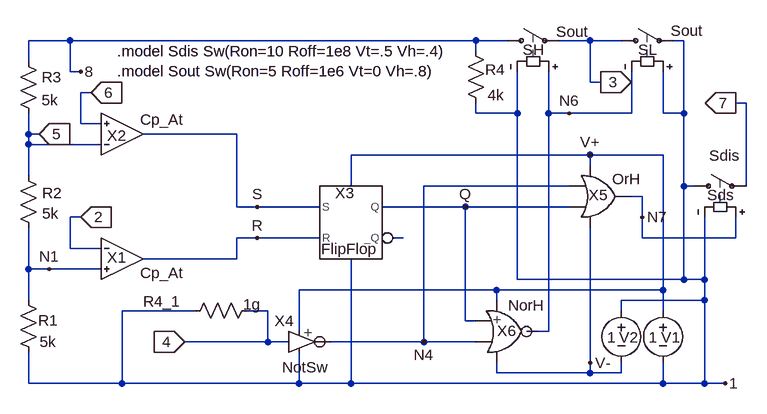
[diagram p0: schematic 555Atan.asc]
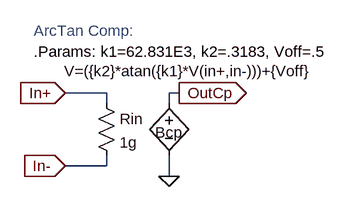
[diagram p1: sub-circuit comp_at.asc]
555Atan.asc, the LTspice schematic file:
Version 4
SHEET 1 880 780
WIRE -576 128 -576 96
WIRE -576 240 -576 208
WIRE -576 256 -576 240
WIRE -576 304 -576 256
WIRE -576 448 -576 384
WIRE -576 496 -576 448
WIRE -576 624 -576 576
WIRE -560 240 -576 240
WIRE -544 448 -576 448
WIRE -512 96 -576 96
WIRE -512 144 -512 96
WIRE -512 416 -512 368
WIRE -496 144 -512 144
WIRE -496 224 -496 176
WIRE -496 368 -512 368
WIRE -480 176 -496 176
WIRE -464 224 -496 224
WIRE -464 256 -576 256
WIRE -464 416 -512 416
WIRE -464 448 -544 448
WIRE -432 624 -576 624
WIRE -432 624 -432 512
WIRE -320 512 -432 512
WIRE -256 240 -400 240
WIRE -256 352 -256 240
WIRE -256 432 -400 432
WIRE -256 432 -256 400
WIRE -224 352 -256 352
WIRE -224 400 -256 400
WIRE -208 512 -240 512
WIRE -208 560 -336 560
WIRE -208 560 -208 512
WIRE -176 560 -208 560
WIRE -160 544 -160 480
WIRE -160 624 -432 624
WIRE -160 624 -160 576
WIRE -128 352 -224 352
WIRE -128 400 -224 400
WIRE -80 320 -80 272
WIRE -80 624 -160 624
WIRE -80 624 -80 432
WIRE 0 400 -16 400
WIRE 32 560 -112 560
WIRE 32 560 32 320
WIRE 96 352 -32 352
WIRE 96 528 96 352
WIRE 112 96 -512 96
WIRE 112 112 112 96
WIRE 112 208 112 192
WIRE 112 528 96 528
WIRE 112 560 32 560
WIRE 144 480 -160 480
WIRE 144 496 144 480
WIRE 144 608 144 592
WIRE 160 96 112 96
WIRE 176 208 112 208
WIRE 176 208 176 144
WIRE 176 464 176 208
WIRE 224 208 224 144
WIRE 224 544 208 544
WIRE 224 544 224 208
WIRE 256 208 224 208
WIRE 256 320 32 320
WIRE 256 352 96 352
WIRE 288 96 240 96
WIRE 288 160 288 96
WIRE 288 272 -80 272
WIRE 288 288 288 272
WIRE 288 592 288 384
WIRE 288 608 144 608
WIRE 288 608 288 592
WIRE 304 160 288 160
WIRE 336 96 288 96
WIRE 336 512 336 496
WIRE 336 608 288 608
WIRE 336 608 336 592
WIRE 352 208 256 208
WIRE 352 208 352 144
WIRE 368 336 352 336
WIRE 368 368 368 336
WIRE 368 400 368 368
WIRE 400 208 400 144
WIRE 400 272 288 272
WIRE 400 480 144 480
WIRE 400 480 400 272
WIRE 400 512 400 480
WIRE 400 624 -80 624
WIRE 400 624 400 592
WIRE 432 96 416 96
WIRE 432 208 400 208
WIRE 432 208 432 96
WIRE 432 320 432 208
WIRE 432 464 176 464
WIRE 432 464 432 320
WIRE 448 320 432 320
WIRE 464 464 432 464
WIRE 464 464 464 368
WIRE 464 496 336 496
WIRE 464 496 464 464
WIRE 464 624 400 624
WIRE 464 624 464 496
WIRE 496 624 464 624
WIRE 512 400 368 400
WIRE 512 400 512 368
WIRE 528 192 512 192
WIRE 528 320 528 192
FLAG -544 448 N1
FLAG -224 400 R
FLAG -496 368 2
IOPIN -496 368 In
FLAG -560 240 5
IOPIN -560 240 In
FLAG 512 192 7
IOPIN 512 192 Out
FLAG 368 368 N7
FLAG -224 352 S
FLAG 96 352 Q
FLAG -480 176 6
IOPIN -480 176 In
FLAG -496 144 8
FLAG 304 160 3
IOPIN 304 160 Out
FLAG 256 208 N6
FLAG 496 624 1
FLAG 32 560 N4
FLAG -336 560 4
IOPIN -336 560 In
FLAG 288 592 V-
FLAG 288 272 V+
SYMBOL res -592 480 R0
WINDOW 0 31 47 Left 0
WINDOW 3 33 80 Left 0
SYMATTR InstName R1
SYMATTR Value 5k
SYMBOL res -592 288 R0
WINDOW 0 37 43 Left 0
WINDOW 3 37 74 Left 0
SYMATTR InstName R2
SYMATTR Value 5k
SYMBOL res -592 112 R0
SYMATTR InstName R3
SYMATTR Value 5k
SYMBOL sw 432 320 R270
WINDOW 0 -14 36 VRight 0
WINDOW 3 47 39 VRight 0
SYMATTR InstName Sds
SYMATTR Value Sdis
SYMBOL sw 144 96 R270
WINDOW 0 -14 40 VRight 0
WINDOW 3 14 92 VRight 0
SYMATTR InstName SH
SYMATTR Value Sout
SYMBOL sw 320 96 R270
WINDOW 0 -14 42 VRight 0
WINDOW 3 15 92 VRight 0
SYMATTR InstName SL
SYMATTR Value Sout
SYMBOL res 128 208 R180
WINDOW 0 -29 67 Left 0
WINDOW 3 -28 28 Left 0
SYMATTR InstName R4
SYMATTR Value 4k
SYMBOL voltage 400 496 R0
WINDOW 0 -3 57 Left 0
WINDOW 3 -22 57 Left 0
SYMATTR InstName V1
SYMATTR Value 1
SYMBOL OrH 304 272 R0
WINDOW 3 18 37 Left 0
SYMATTR InstName X5
SYMBOL NorH 160 480 R0
WINDOW 3 2 24 Left 0
SYMATTR InstName X6
SYMBOL ff -80 304 R0
SYMATTR InstName X3
SYMBOL voltage 336 496 R0
WINDOW 0 -3 57 Left 0
WINDOW 3 -22 57 Left 0
SYMATTR InstName V2
SYMATTR Value 1
SYMBOL NotSw -176 496 R0
SYMATTR InstName X4
SYMBOL res -224 496 R90
WINDOW 0 17 147 VBottom 0
WINDOW 3 -9 8 VTop 0
SYMATTR InstName R4_1
SYMATTR Value 1g
SYMBOL Comp_At -432 368 R0
SYMATTR InstName X1
SYMBOL Comp_At -432 304 M180
SYMATTR InstName X2
TEXT -440 112 Left 0 !.model Sdis Sw(Ron=10 Roff=1e8 Vt=.5 Vh=.4)\n.model Sout Sw(Ron=5 Roff=1e6 Vt=0 Vh=.8)

comp_at.asc, the sub-circuit schematic file:
Version 4
SHEET 1 880 680
WIRE -32 192 -96 192
WIRE -32 208 -32 192
WIRE -32 304 -96 304
WIRE -32 304 -32 288
WIRE 64 208 64 192
WIRE 64 320 64 288
WIRE 80 192 64 192
FLAG -96 192 In+
IOPIN -96 192 In
FLAG -96 304 In-
IOPIN -96 304 In
FLAG 80 192 OutCp
IOPIN 80 192 Out
FLAG 64 320 0
SYMBOL bv 64 192 R0
WINDOW 0 -21 61 Left 0
WINDOW 3 -161 -34 Left 0
SYMATTR InstName Bcp
SYMATTR Value V=({k2}*atan({k1}*V(in+,in-)))+{Voff}
SYMBOL res -48 192 R0
SYMATTR InstName Rin
SYMATTR Value 1g
TEXT -144 128 Left 0 !.Params: k1=62.831E3, k2=.3183, Voff=.5
TEXT -144 96 Left 0 ;ArcTan Comp:

The netlist it stands for:
* 555Atan.asc
R1 N1 1 5k
R2 5 N1 5k
R3 8 5 5k
Sds 1 7 N7 1 Sdis
SH 8 3 N6 1 Sout
SL 3 1 1 N6 Sout
R4 1 8 4k
V1 V+ 1 1
XX5 N4 Q V+ V- N7 OrH params: OrH  ; pins A B V+ V- Y
XX6 Q N4 V+ V- N6 NorH params: NorH  ; pins A B V+ V- Y
XX3 S R V+ 1 Q N001 ff params: FlipFlop  ; pins S R V+ 1 Q _Q
V2 1 V- 1
XX4 4 V+ 1 N4 NotSw params: NotSw  ; pins in V+ 1 _Q
R4_1 4 1 1g
XX1 N1 2 R comp_at params: Cp_At
XX2 6 5 S comp_at params: Cp_At

* block symbol definitions
.subckt comp_at In+ In- OutCp
Bcp OutCp 0 V=({k2}*atan({k1}*V(in+,in-)))+{Voff}
Rin In+ In- 1g
.Params: k1=62.831E3, k2=.3183, Voff=.5
* ArcTan Comp:
.ends comp_at

.model Sdis Sw(Ron=10 Roff=1e8 Vt=.5 Vh=.4)
.model Sout Sw(Ron=5 Roff=1e6 Vt=0 Vh=.8)
.backanno
.end